# EAGLE design GhostbustersR1-FIXED (EAGLE 9.6.2)
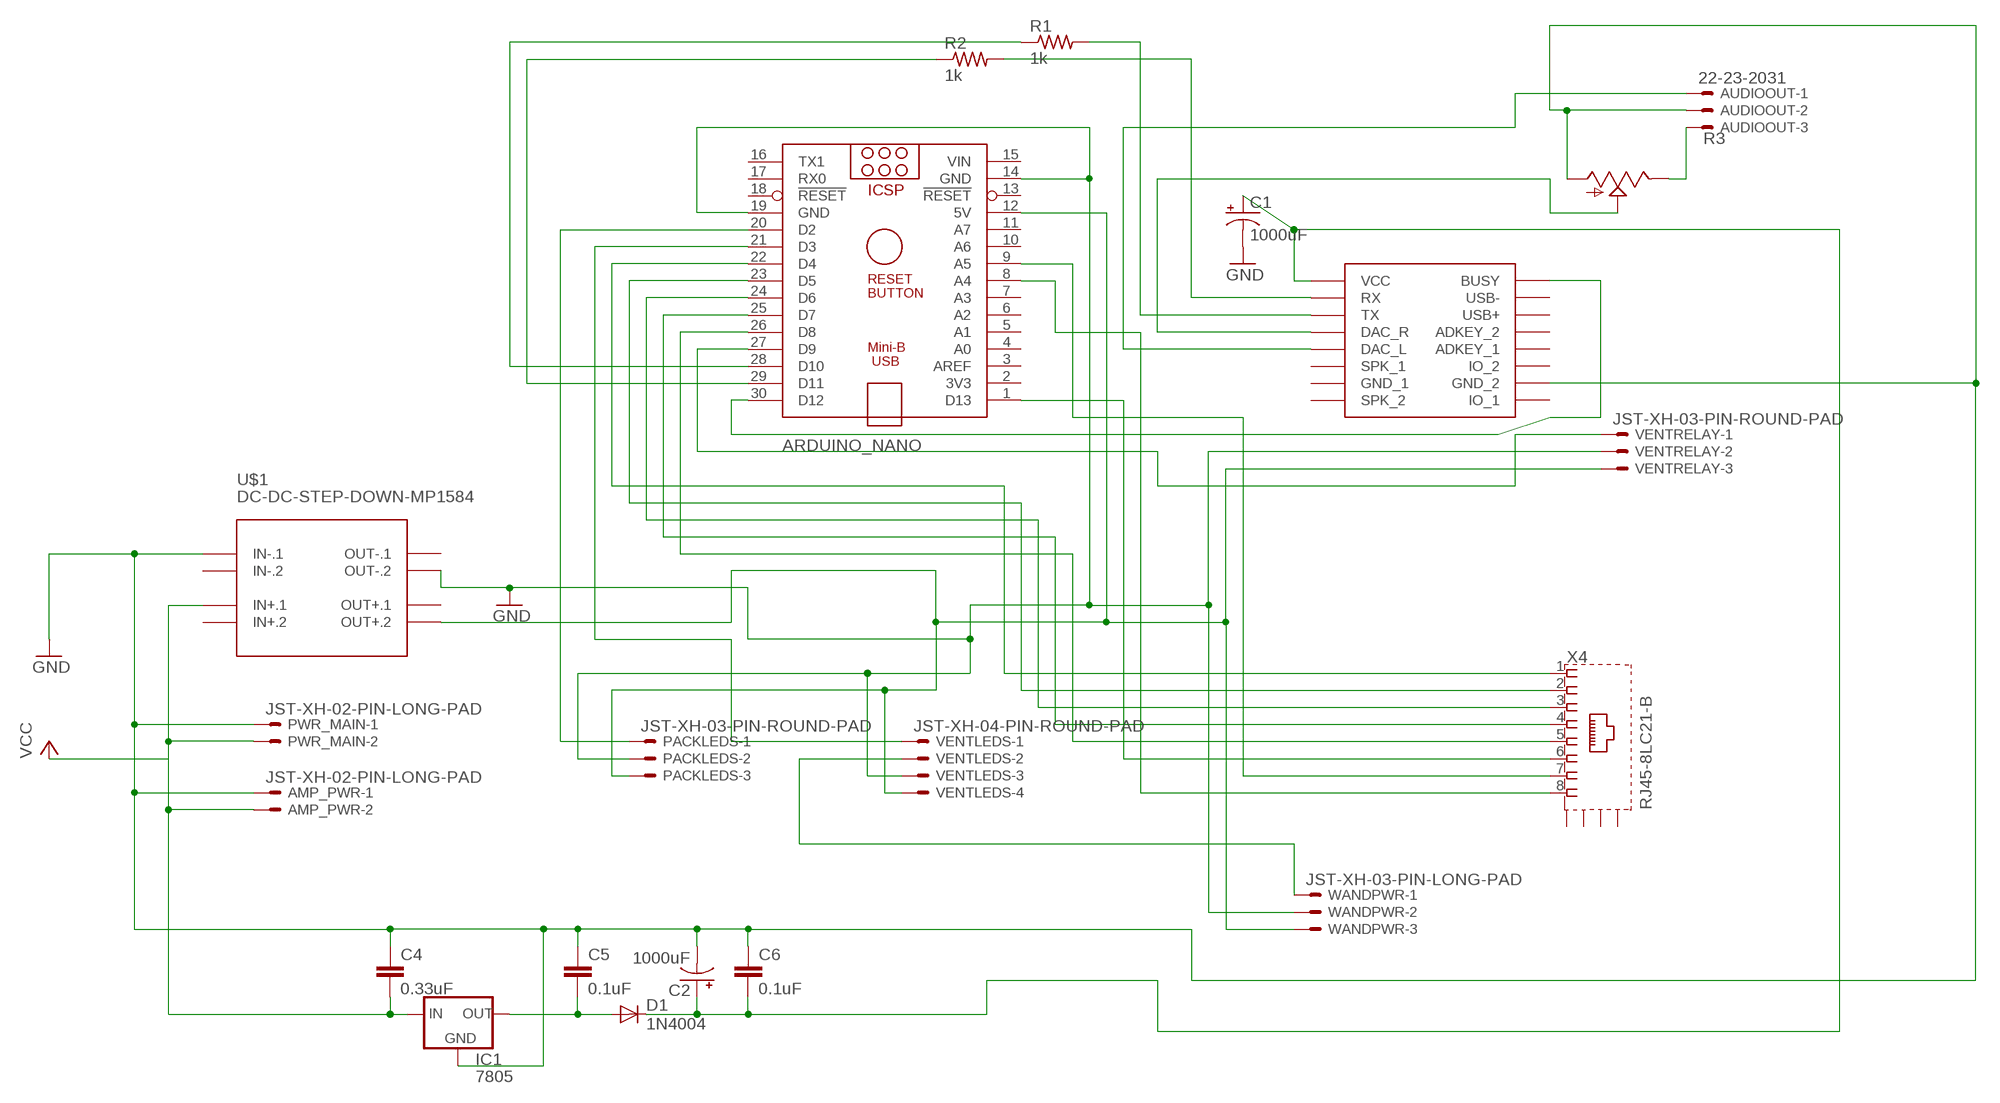
[diagram p0: schematic, sheet 1]

## Parts
AMP_PWR  JST-XH-02-PIN-LONG-PAD  [JST-XH-02-PACKAGE-LONG-PAD]
ARDUINO_NANO  ARDUINO_NANO  [ARDUINO_NANO]
AUDIOOUT  22-23-2031  [22-23-2031]
C1  1000uF  CPOL-USE3.5-8  [E3,5-8]
C2  1000uF  CPOL-USE3.5-8  [E3,5-8]
C4  0.33uF  C2.5/4  [C2.5-4]
C5  0.1uF  C2.5/4  [C2.5-4]
C6  0.1uF  C2.5/4  [C2.5-4]
D1  1N4004  [DO41-10]
DFPLAYER  DFPLAYER  [DFPLAYER]
IC1  7805  78MXXS  [78MXXS]
PACKLEDS  JST-XH-03-PIN-ROUND-PAD  [JST-XH-03-PACKAGE-ROUND-PAD]
PWR_MAIN  JST-XH-02-PIN-LONG-PAD  [JST-XH-02-PACKAGE-LONG-PAD]
R1  1k  R-US_0207/12  [0207/12]
R2  1k  R-US_0207/12  [0207/12]
R3  TRIM_US-B64Y  [B64Y]
U$1  DC-DC-STEP-DOWN-MP1584  [DC-DC-STEP-DOWN-MP1584]
VENTLEDS  JST-XH-04-PIN-ROUND-PAD  [JST-XH-04-PACKAGE-ROUND-PAD]
VENTRELAY  JST-XH-03-PIN-ROUND-PAD  [JST-XH-03-PACKAGE-ROUND-PAD]
WANDPWR  JST-XH-03-PIN-LONG-PAD  [JST-XH-03-PACKAGE-LONG-PAD]
X4  RJ45-8LC21-B  [RJ45-SHIELD1]

## Nets
GND: AMP_PWR.1 ARDUINO_NANO.14(GND) ARDUINO_NANO.19(GND) AUDIOOUT.2 C1.- C2.- C4.1 C5.1 C6.1 DFPLAYER.GND_2 IC1.GND PACKLEDS.2 PWR_MAIN.1 R3.A U$1.IN-.1 U$1.OUT-.2 VENTLEDS.3 VENTRELAY.2 WANDPWR.2
N$1: ARDUINO_NANO.12(5V) PACKLEDS.3 U$1.OUT+.2 VENTLEDS.4 VENTRELAY.3 WANDPWR.3
N$2: ARDUINO_NANO.25(D7) X4.4
N$4: AUDIOOUT.3 R3.E
N$5: ARDUINO_NANO.29(D11) R2.1
N$6: ARDUINO_NANO.28(D10) R1.1
N$9: ARDUINO_NANO.20(D2) PACKLEDS.1
N$10: ARDUINO_NANO.21(D3) VENTLEDS.1
N$11: VENTLEDS.2 WANDPWR.1
N$12: ARDUINO_NANO.22(D4) X4.1
N$13: ARDUINO_NANO.23(D5) X4.2
N$14: ARDUINO_NANO.24(D6) X4.3
N$15: ARDUINO_NANO.26(D8) X4.5
N$16: ARDUINO_NANO.1(D13) X4.6
N$17: ARDUINO_NANO.30(D12) DFPLAYER.BUSY
N$18: DFPLAYER.DAC_R R3.S
N$19: AUDIOOUT.1 DFPLAYER.DAC_L
N$20: ARDUINO_NANO.27(D9) VENTRELAY.1
N$22: ARDUINO_NANO.8(A4) X4.8
N$23: ARDUINO_NANO.9(A5) X4.7
N$25: DFPLAYER.TX R1.2
N$26: DFPLAYER.RX R2.2
N$27: C5.2 D1.A IC1.OUT
N$28: C1.+ C2.+ C6.2 D1.C DFPLAYER.VCC
VCC: AMP_PWR.2 C4.2 IC1.IN PWR_MAIN.2 U$1.IN+.1
Unconnected: ARDUINO_NANO.2(3V3) ARDUINO_NANO.3(AREF) ARDUINO_NANO.4(A0) ARDUINO_NANO.5(A1) ARDUINO_NANO.6(A2) ARDUINO_NANO.7(A3) ARDUINO_NANO.10(A6) ARDUINO_NANO.11(A7) ARDUINO_NANO.13(!RESET) ARDUINO_NANO.16(TX1) ARDUINO_NANO.17(RX0) ARDUINO_NANO.18(!RESET) DFPLAYER.ADKEY1(ADKEY_1) DFPLAYER.ADKEY2(ADKEY_2) DFPLAYER.GND_1 DFPLAYER.IO1(IO_1) DFPLAYER.IO2(IO_2) DFPLAYER.SPK1(SPK_1) DFPLAYER.SPK2(SPK_2) DFPLAYER.USB+ DFPLAYER.USB- U$1.IN+.2 U$1.IN-.2 U$1.OUT+.1 U$1.OUT-.1 X4.S1(S) X4.S2(S) X4.S3(S) X4.S4(S)

## Power pins joined to a net without a drawn wire
VIN: ARDUINO_NANO.15(VIN)

## Library data of the parts
AMP_PWR PWR_MAIN = Rembrandt Electronics - JST XH Connectors v1-0:JST-XH-02-PIN: JST XH Connector 2 Pin Wire to board connector. Pitch: 2,54 mm, (0.100") Number of pins: 2 Created by Rembrandt Electronics www.rembrandtelectronics.com
ARDUINO_NANO = ArduinoNanoV30:ARDUINO_NANO: Arduino Nano V3.0 Overview: The Arduino Nano is a small, complete, and breadboard-friendly board based on the ATmega328 (Arduino Nano 3.x) or ATmega168 (Arduino Nano 2.x). It has more or less the same functionality of the Arduino Duemilanove, but in a different package. It lacks only a DC power jack, and works with a Mini-B USB cable instead of a standard one. The Nano was designed and is being produced by Gravitech. Specifications: Microcontroller Atmel ATmega168 or ATmega328 Operating Voltage (logic level) 5 V Input Voltage (recommended) 7-12 V Input Voltage (limits) 6-20 V Digital I/O Pins 14 (of which 6 provide PWM output) Analog Input Pins 8 DC Current per I/O Pin 40 mA Flash Memory 16 KB (ATmega168) or 32 KB (ATmega328) of which 2 KB used by bootloader SRAM 1 KB (ATmega168) or 2 KB (ATmega328) EEPROM 512 bytes (ATmega168) or 1 KB (ATmega328) Clock Speed 16 MHz Dimensions 0.73" x 1.70" Length 45 mm Width 18 mm Weigth 5 g Power: The Arduino Nano can be powered via the Mini-B USB connection, 6-20V unregulated external power supply (pin 30), or 5V regulated external power supply (pin 27). The power source is automatically selected to the highest voltage source. Memory: The ATmega168 has 16 KB of flash memory for storing code (of which 2 KB is used for the bootloader); the ATmega328 has 32 KB, (also with 2 KB used for the bootloader). The ATmega168 has 1 KB of SRAM and 512 bytes of EEPROM (which can be read and written with the EEPROM library); the ATmega328 has 2 KB of SRAM and 1 KB of EEPROM. Input and Output: Each of the 14 digital pins on the Nano can be used as an input or output, using pinMode(), digitalWrite(), and digitalRead() functions. They operate at 5 volts. Each pin can provide or receive a maximum of 40 mA and has an internal pull-up resistor (disconnected by default) of 20-50 kOhms. In addition, some pins have specialized functions. Visit Arduino - ArduinoBoardNano <https://www.arduino.cc/en/Main/ArduinoBoardNano>
AUDIOOUT = con-molex:22-23-2031: .100" (2.54mm) Center Header - 3 Pin; MF: MOLEX; MPN: 22-23-2031; OC_FARNELL: 1462950; OC_NEWARK: 30C0862
C1 C2 = adafruit:CPOL-US: POLARIZED CAPACITOR, American symbol
C4-C6 = capacitor-wima:C: CAPACITOR naming: grid - package width
D1 = adafruit:1N4004: DIODE General purpose 1N400x type rectifier (With bigger pads) http://www.ladyada.net/library/pcb/eaglelibrary.html
DFPLAYER = DFPlayer_v1:DFPLAYER
IC1 = v-reg:78MXXS: VOLTAGE REGULATOR
PACKLEDS VENTRELAY WANDPWR = Rembrandt Electronics - JST XH Connectors v1-0:JST-XH-03-PIN: JST XH Connector 2 Pin Wire to board connector. Pitch: 2,54 mm, (0.100") Number of pins: 3 Created by Rembrandt Electronics www.rembrandtelectronics.com
R1 R2 = adafruit:R-US_: RESISTOR, American symbol
R3 = pot:TRIM_US-: POTENTIOMETER
U$1 = diy-modules:DC-DC-STEP-DOWN-MP1584: DC/DC Step-Down Regulator based on MP1584 chip MP1584 datasheet available here: http://www.haoyuelectronics.com/Attachment/MP1584/MP1584.pdf Click here to find device on ebay.com <http://www.ebay.com/sch/mp1584+module>
VENTLEDS = Rembrandt Electronics - JST XH Connectors v1-0:JST-XH-04-PIN: JST XH Connector 2 Pin Wire to board connector. Pitch: 2,54 mm, (0.100") Number of pins: 4 Created by Rembrandt Electronics www.rembrandtelectronics.com
X4 = con-tycoelectronics:RJ45*2: RJ45 Low Profile Shield Type 2 For all RJ45 L, LC, LCT and X Series Models Source: www.tycoelectronics.com .. ENG_DS_1654001_1099_RJ_L_0507.pdf; OC_FARNELL: unknown; OC_NEWARK: unknown

## Board
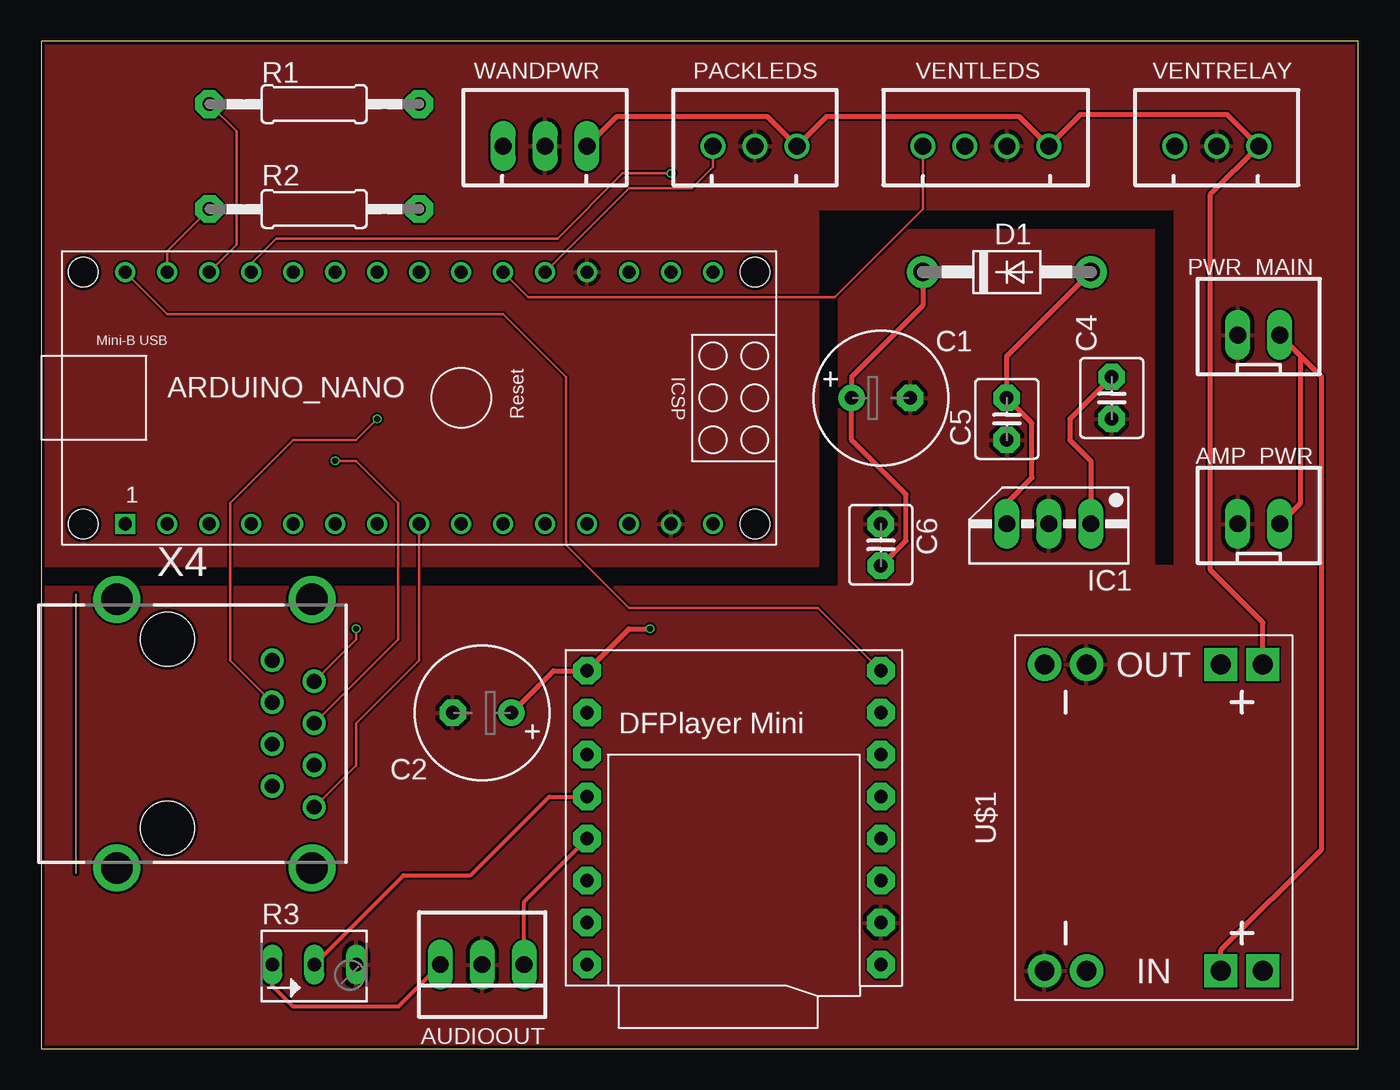
[diagram p1: board, top side]
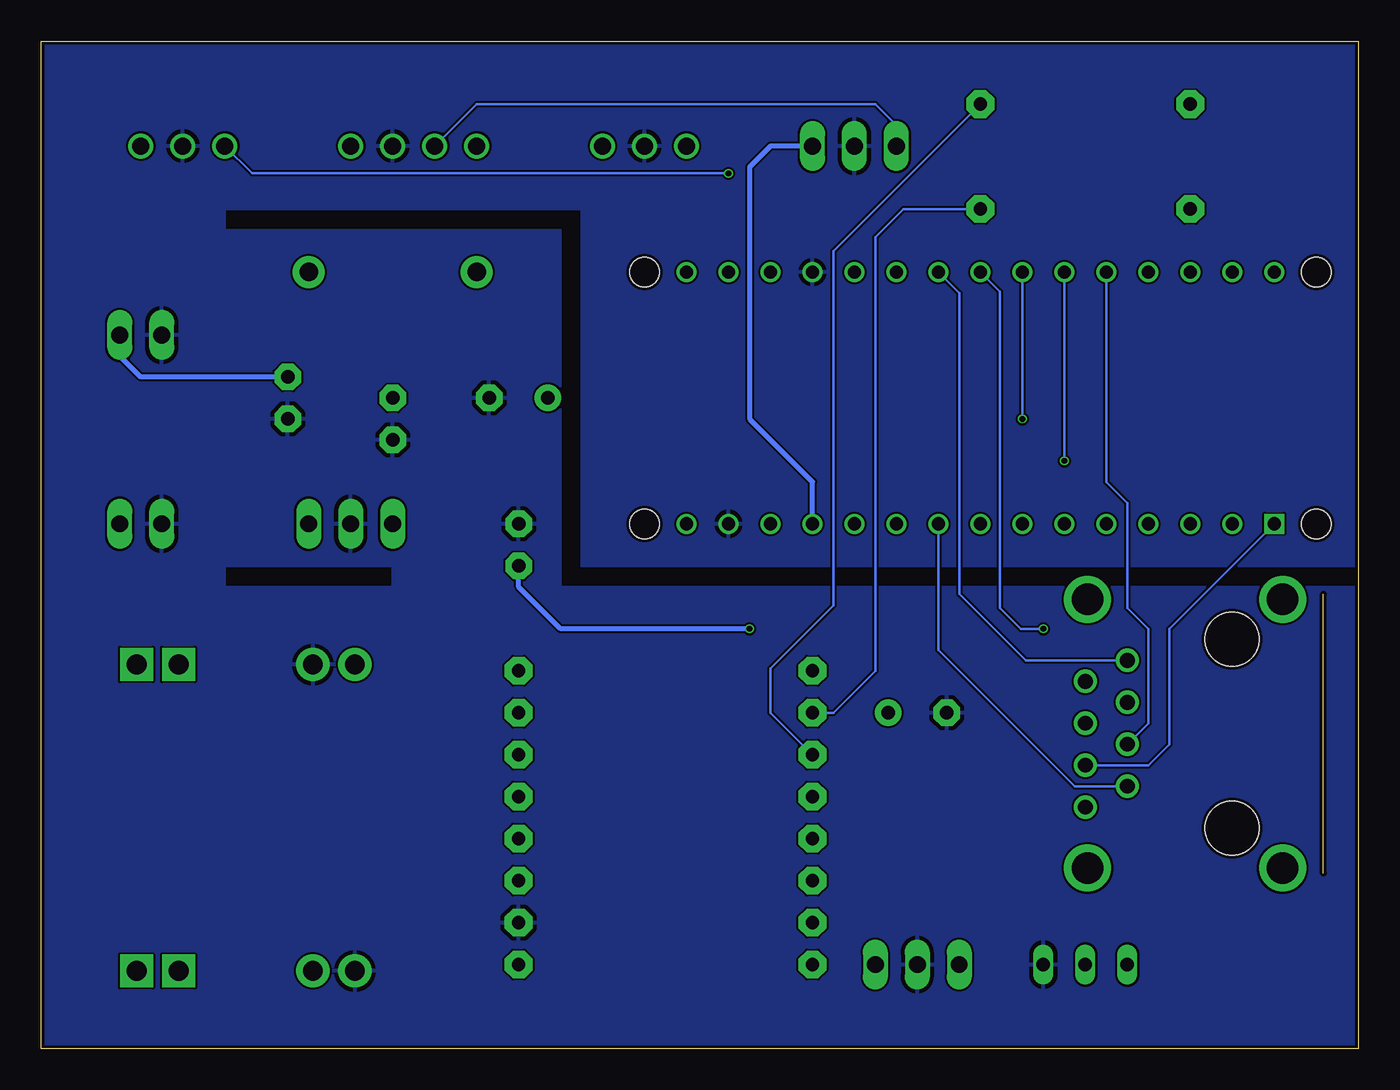
[diagram p2: board, bottom side, seen from below]

Size 79.68 x 60.95 mm. Coordinates in mm from the lower left corner, seen from the top.
Outline: 0,0 79.68,0 79.68,60.95 0,60.95 0,0
Copper layers (1*16): Top 0.035559375mm / dielectric 1.6mm / Bottom 0.035559375mm
Design rules "jlcpcb-2layer": minimum track width 5mil, minimum drill 12mil, track to track 5mil, track to pad 5mil, pad to pad 5mil, via to via 5mil, smd to smd 5mil, copper to edge 8mil, drill to drill 6mil, minimum pad ring 5mil, minimum via ring 3mil, stop-mask expansion 2.5mil, vias tented up to drill 0mil, thermal gap 10mil

### Footprints (pad centres in the part's own frame; a part is rotated, then mirrored left to right if it is on the bottom)
JST-XH-02-PACKAGE-LONG-PAD = drill 1.016 long: 1 -1.27,0; 2 1.27,0
ARDUINO_NANO = drill 0.8 square: 1 -20.32,-7.62 | drill 0.8: 2 -17.78,-7.62; 3 -15.24,-7.62; 4 -12.7,-7.62; 5 -10.16,-7.62; 6 -7.62,-7.62; 7 -5.08,-7.62; 8 -2.54,-7.62; 9 0,-7.62; 10 2.54,-7.62; 11 5.08,-7.62; 12 7.62,-7.62; 13 10.16,-7.62; 14 12.7,-7.62; 15 15.24,-7.62; 16 15.24,7.62; 17 12.7,7.62; 18 10.16,7.62; 19 7.62,7.62; 20 5.08,7.62; 21 2.54,7.62; 22 0,7.62; 23 -2.54,7.62; 24 -5.08,7.62; 25 -7.62,7.62; 26 -10.16,7.62; 27 -12.7,7.62; 28 -15.24,7.62; 29 -17.78,7.62; 30 -20.32,7.62 | hole 1.778: -22.86,-7.62; -22.86,7.62; 17.78,7.62; 17.78,-7.62
22-23-2031 = drill 1 long: 1 -2.54,0; 2 0,0; 3 2.54,0
E3,5-8 = drill 0.813 pad 1.6: + -1.778,0 | drill 0.813 pad 1.6 octagon: - 1.778,0
C2.5-4 = drill 0.813 pad 1.6 octagon: 1 -1.27,0; 2 1.27,0
DO41-10 = drill 1.118 pad 1.93: A 5.08,0; C -5.08,0
DFPLAYER = drill 0.8 pad 1.676 octagon: ADKEY1 8.89,-1.27; ADKEY2 8.89,1.27; BUSY 8.89,8.89; DAC_L -8.89,-1.27; DAC_R -8.89,1.27; GND_1 -8.89,-6.35; GND_2 8.89,-6.35; IO1 8.89,-8.89; IO2 8.89,-3.81; RX -8.89,6.35; SPK1 -8.89,-3.81; SPK2 -8.89,-8.89; TX -8.89,3.81; USB+ 8.89,3.81; USB- 8.89,6.35; VCC -8.89,8.89
78MXXS = drill 1.016 long: GND 0,-2.54; IN -2.54,-2.54; OUT 2.54,-2.54
JST-XH-03-PACKAGE-ROUND-PAD = drill 1.016: 1 -2.54,0; 2 0,0; 3 2.54,0
0207/12 = drill 0.813 pad 1.676 octagon: 1 -6.35,0; 2 6.35,0
B64Y = drill 0.813 long: A 2.54,0; E -2.54,0; S 0,0
DC-DC-STEP-DOWN-MP1584 = drill 1.2 pad 2 square: IN+.1 -9.271,-4.064; IN+.2 -9.271,-6.604; OUT+.1 9.271,-4.064; OUT+.2 9.271,-6.604 | drill 1.2 pad 2: IN-.1 -9.271,6.604; IN-.2 -9.271,4.064; OUT-.1 9.271,6.604; OUT-.2 9.271,4.064
JST-XH-04-PACKAGE-ROUND-PAD = drill 1.016: 1 -3.81,0; 2 -1.27,0; 3 1.27,0; 4 3.81,0
JST-XH-03-PACKAGE-LONG-PAD = drill 1.016 long: 1 -2.54,0; 2 0,0; 3 2.54,0
RJ45-SHIELD1 = drill 0.9 pad 1.4: 1 -4.445,6.35; 2 -3.175,8.89; 3 -1.905,6.35; 4 -0.635,8.89; 5 0.635,6.35; 6 1.905,8.89; 7 3.175,6.35; 8 4.445,8.89 | drill 1.9 pad 2.5: S1 -8.128,-3.048; S2 8.128,-3.048; S3 -8.128,8.76; S4 8.128,8.76 | hole 3.251: -5.715,0; 5.715,0

### Placement (x,y rotation side)
AMP_PWR  73.66,31.75 0 top
ARDUINO_NANO  25.4,39.37 0 top
AUDIOOUT  26.67,5.08 180 top
C1  50.8,39.37 0 top
C2  26.67,20.32 180 top
C4  64.77,39.37 90 top
C5  58.42,38.1 90 top
C6  50.8,30.48 270 top
D1  58.42,46.99 0 top
DFPLAYER  41.91,13.97 0 top
IC1  60.96,29.21 180 top
PACKLEDS  43.18,54.61 0 top
PWR_MAIN  73.66,43.18 0 top
R1  16.51,57.15 0 top
R2  16.51,50.8 0 top
R3  16.51,5.08 0 top
U$1  67.31,13.97 90 top
VENTLEDS  57.15,54.61 0 top
VENTRELAY  71.12,54.61 0 top
WANDPWR  30.48,54.61 0 top
X4  7.62,19.05 270 top

### Tracks (layer width: path | path; a pad name or v marks a point on that pad's centre or on a via)
GND
  pour Bottom: 0,0 58.42,0 58.42,29.21 68.58,29.21 68.58,49.53 48.26,49.53 48.26,27.94 0,27.94
  pour Bottom: 0,29.21 46.99,29.21 46.99,50.8 68.58,50.8 68.58,27.94 58.42,27.94 58.42,0 80.01,0 80.01,60.96 0,60.96
  pour Top: 58.42,0 0,0 0,27.94 48.26,27.94 48.26,49.53 67.31,49.53 67.31,29.21 58.42,29.21
  pour Top: 46.99,29.21 0,29.21 0,60.96 80.01,60.96 80.01,0 58.42,0 58.42,29.21 68.58,29.21 68.58,50.8 46.99,50.8
N$1
  Top 0.305: U$1.OUT+.2 73.91,25.78 70.74,28.96 70.74,51.69 VENTRELAY.3 71.75,56.52 62.86,56.52 VENTLEDS.4 59.18,56.39 47.5,56.39 PACKLEDS.3 43.94,56.39 34.8,56.39 WANDPWR.3
  Bottom 0.305: WANDPWR.3 35.56,54.61 36.83,53.34 36.83,38.1 33.02,34.29 ARDUINO_NANO.12
N$2  (via drill 0.35)
  Top 0.152: X4.4 21.59,24.77 21.59,33.02 19.05,35.56 v17.78,35.56
  Bottom 0.152: ARDUINO_NANO.25 v17.78,35.56
N$4
  Top 0.254: AUDIOOUT.3 21.59,2.54 15.24,2.54 13.97,3.81 R3.E
N$5
  Top 0.152: R2.1 7.62,48.26 ARDUINO_NANO.29
N$6
  Top 0.152: R1.1 11.81,55.5 11.81,48.64 ARDUINO_NANO.28
N$9
  Top 0.152: PACKLEDS.1 40.64,53.34 39.37,52.07 35.56,52.07 ARDUINO_NANO.20
N$10
  Top 0.152: ARDUINO_NANO.21 29.46,45.47 48.01,45.47 53.34,50.8 VENTLEDS.1
N$11
  Bottom 0.152: WANDPWR.1 27.94,55.88 29.21,57.15 53.34,57.15 VENTLEDS.2
N$12
  Bottom 0.152: X4.1 20.12,23.49 24.13,27.51 24.13,45.72 ARDUINO_NANO.22
N$13  (via drill 0.35)
  Top 0.152: v19.05,25.4 19.05,24.77 X4.2
  Bottom 0.152: ARDUINO_NANO.23 21.67,45.8 21.67,26.66 20.41,25.4 v19.05,25.4
N$14  (via drill 0.35)
  Top 0.152: X4.3 11.43,23.49 11.43,33.02 15.24,36.83 19.05,36.83 v20.32,38.1
  Bottom 0.152: ARDUINO_NANO.24 v20.32,38.1
N$15
  Bottom 0.152: X4.5 12.7,19.68 12.7,25.4 13.97,26.67 13.97,33.02 15.24,34.29 ARDUINO_NANO.26
N$16
  Bottom 0.152: X4.6 12.7,17.14 11.43,18.41 11.43,25.4 ARDUINO_NANO.1
N$17
  Top 0.152: DFPLAYER.BUSY 46.99,26.67 35.56,26.67 31.75,30.48 31.75,40.64 27.94,44.45 7.62,44.45 ARDUINO_NANO.30
N$18
  Top 0.254: R3.S 21.92,10.49 25.98,10.49 30.73,15.24 DFPLAYER.DAC_R
N$19
  Top 0.254: AUDIOOUT.1 29.21,8.89 DFPLAYER.DAC_L
N$20  (via drill 0.35)
  Top 0.152: ARDUINO_NANO.27 12.7,47.5 14.22,49.02 31.24,49.02 35.18,52.96 v38.1,52.96
  Bottom 0.152: v38.1,52.96 66.93,52.96 VENTRELAY.1
N$22
  Top 0.152: ARDUINO_NANO.8 22.86,23.49 19.05,19.68 19.05,17.14 X4.8
N$23
  Bottom 0.152: X4.7 17.14,15.88 25.4,24.13 ARDUINO_NANO.9
N$25
  Bottom 0.152: DFPLAYER.TX 35.56,20.32 35.56,22.99 31.75,26.8 31.75,48.26 R1.2
N$26
  Bottom 0.152: R2.2 27.51,50.8 29.22,49.09 29.22,22.85 31.75,20.32 DFPLAYER.RX
N$27
  Top 0.305: D1.A 58.42,41.91 C5.2 59.94,37.85 59.94,34.54 58.42,33.02 IC1.OUT
N$28  (via drill 0.35)
  Top 0.305: C2.+ 30.99,22.86 DFPLAYER.VCC 35.56,25.4 v36.83,25.4 | D1.C 53.34,44.96 49.02,40.64 C1.+ 49.02,36.83 52.32,33.53 52.32,30.73 C6.2
  Bottom 0.305: v36.83,25.4 48.26,25.4 50.8,27.94 C6.2
VCC
  Top 0.305: AMP_PWR.2 76.2,33.02 76.2,41.91 PWR_MAIN.2 77.47,40.64 77.47,12.07 71.37,5.97 U$1.IN+.1 | C4.2 62.23,38.1 62.23,36.83 63.5,35.56 IC1.IN
  Bottom 0.305: C4.2 73.66,40.64 74.93,41.91 PWR_MAIN.2